# EAGLE design flight sim sch (EAGLE 9.6.2)
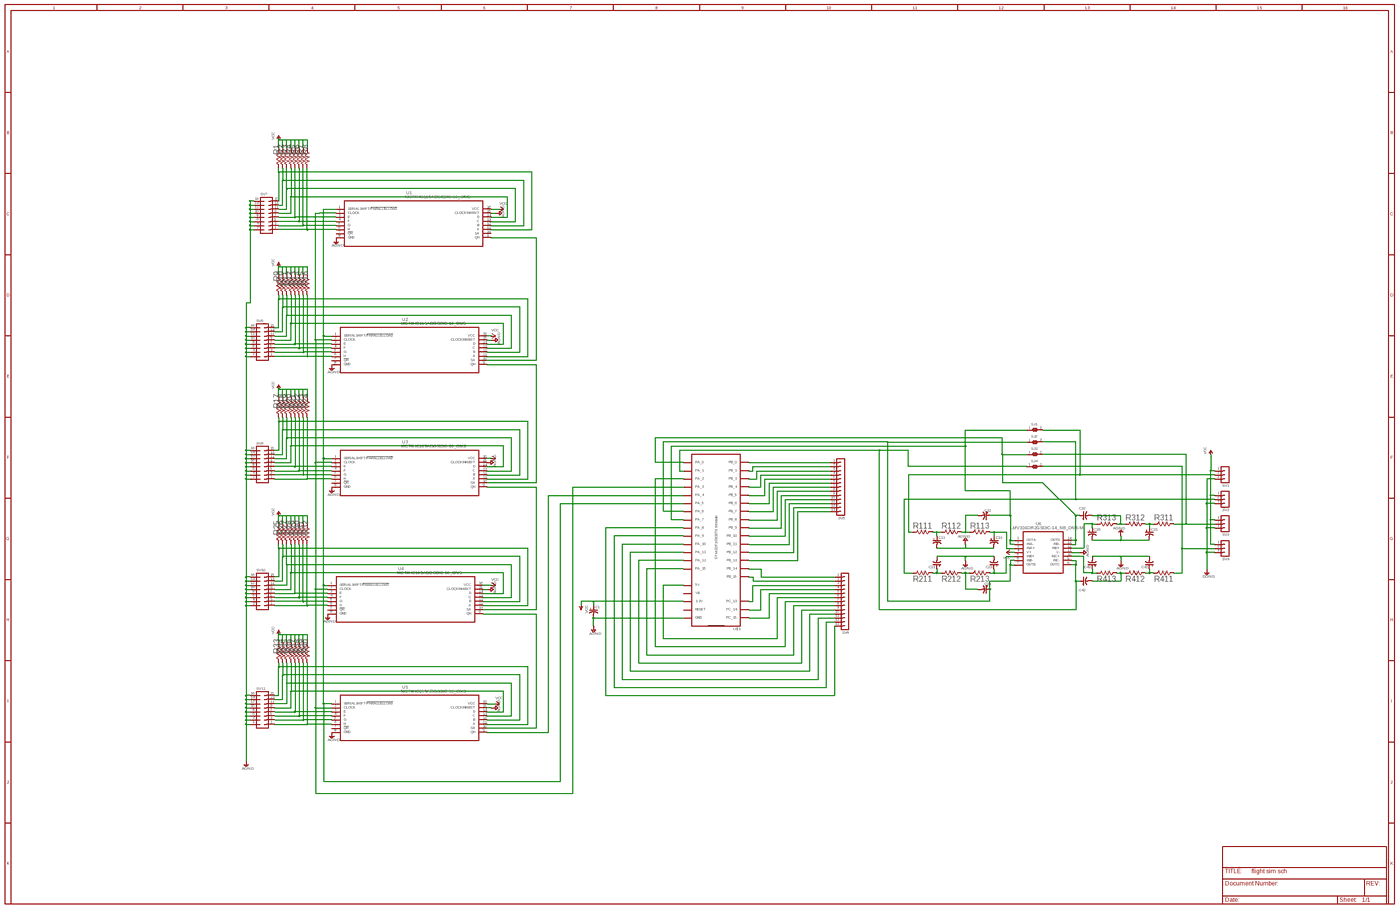
[diagram p0: schematic, sheet 1, overview]
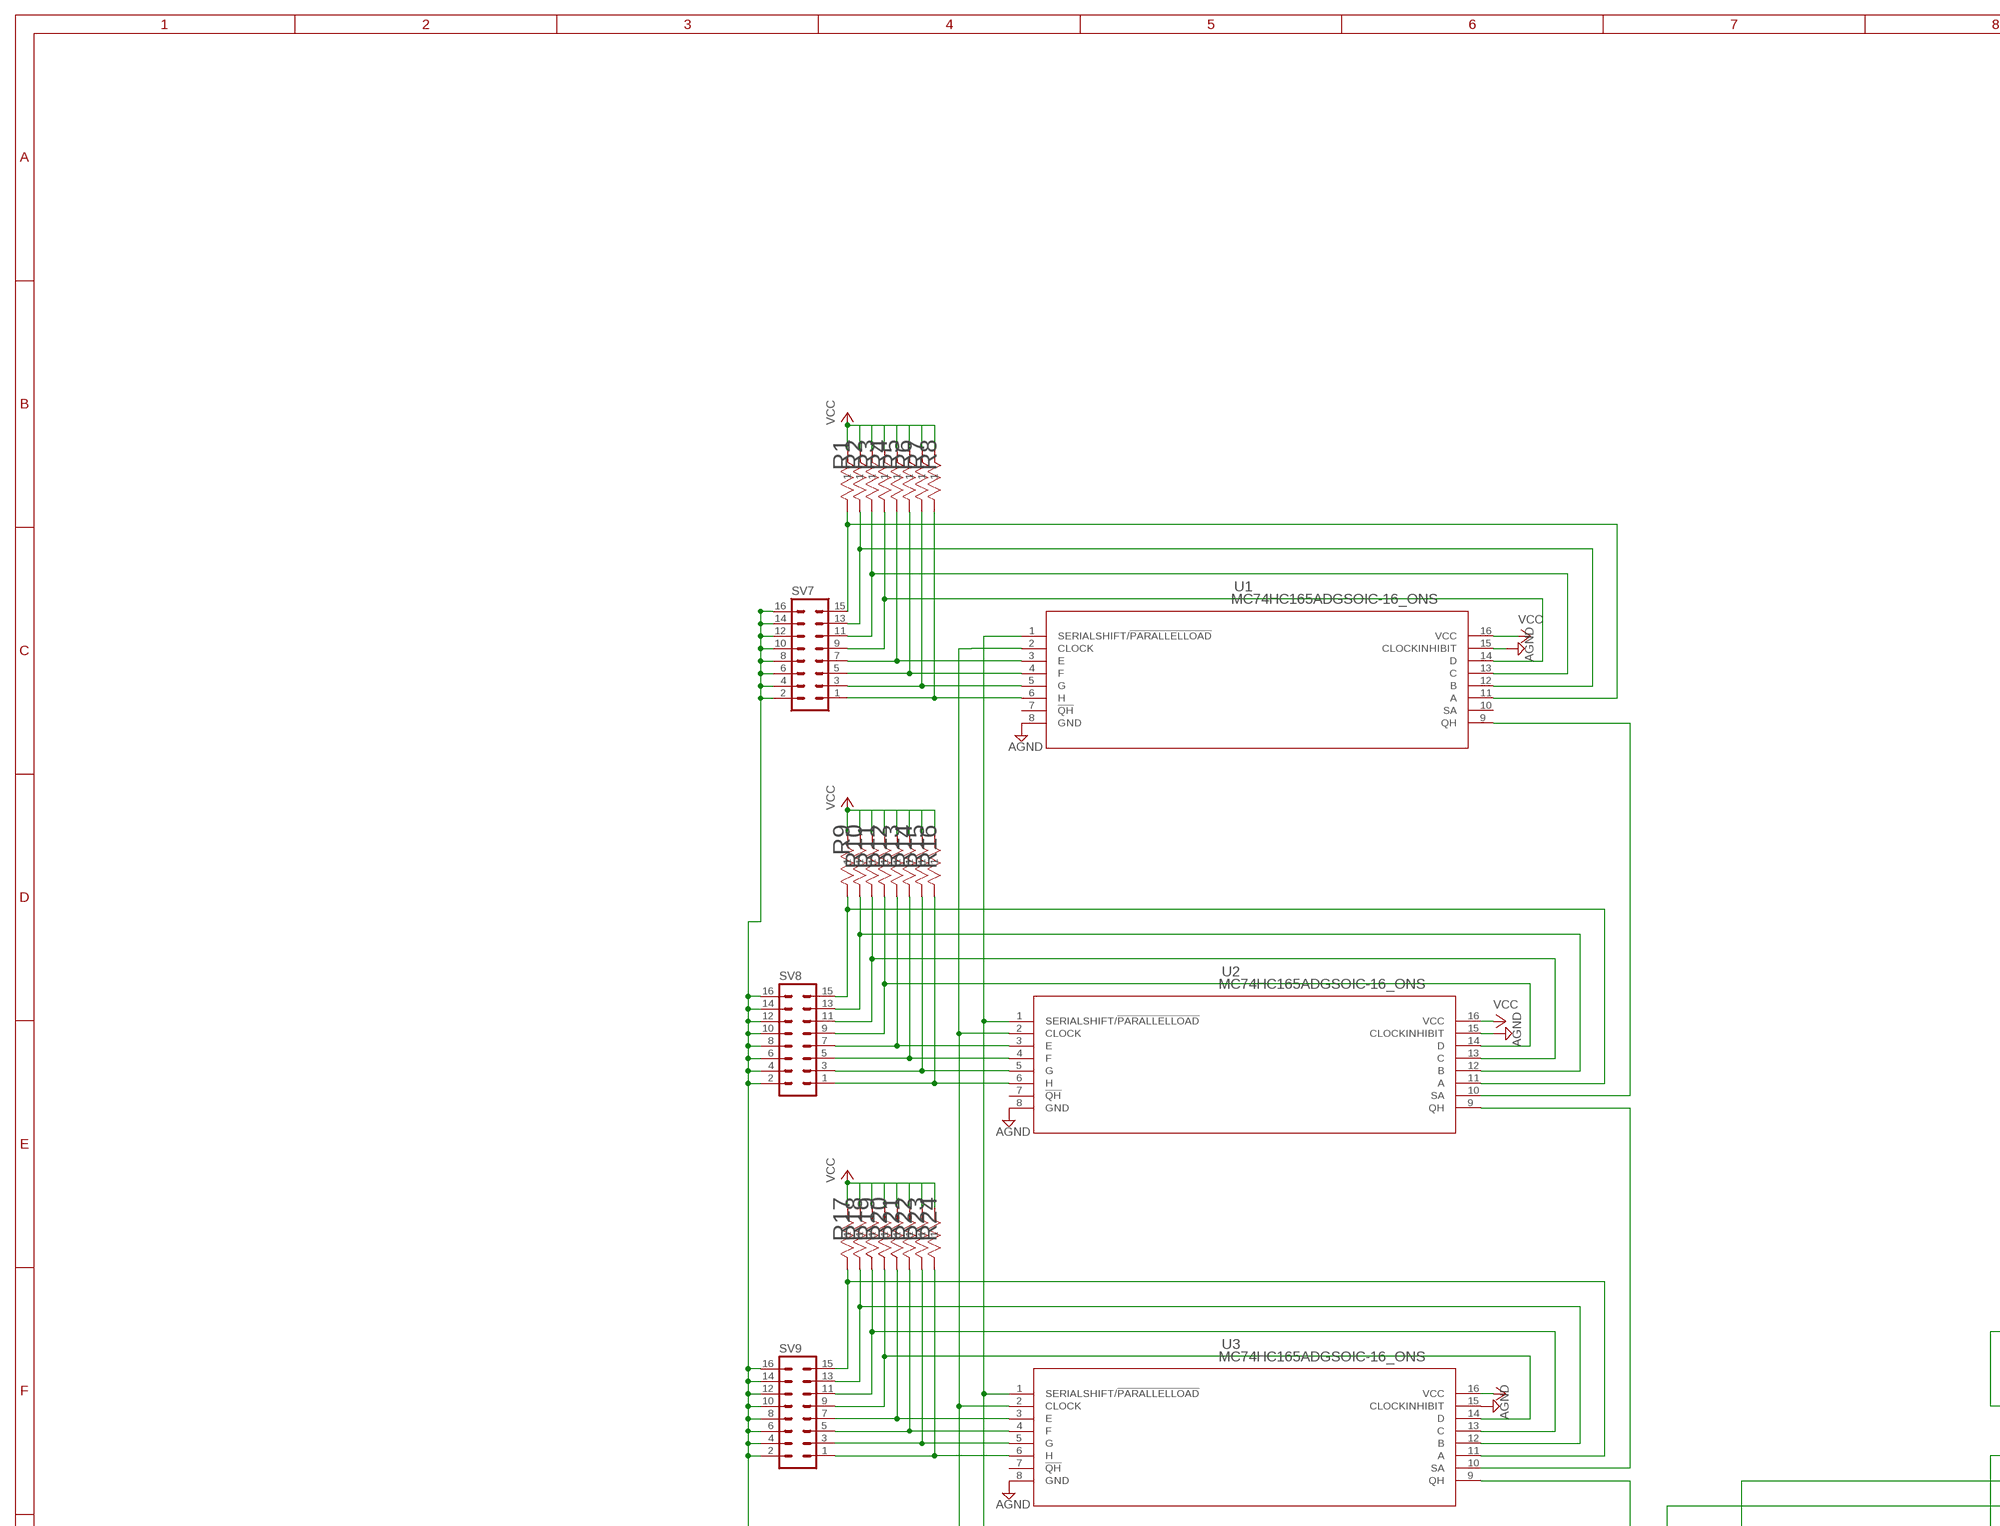
[diagram p1: schematic, sheet 1, part 1 of 4]
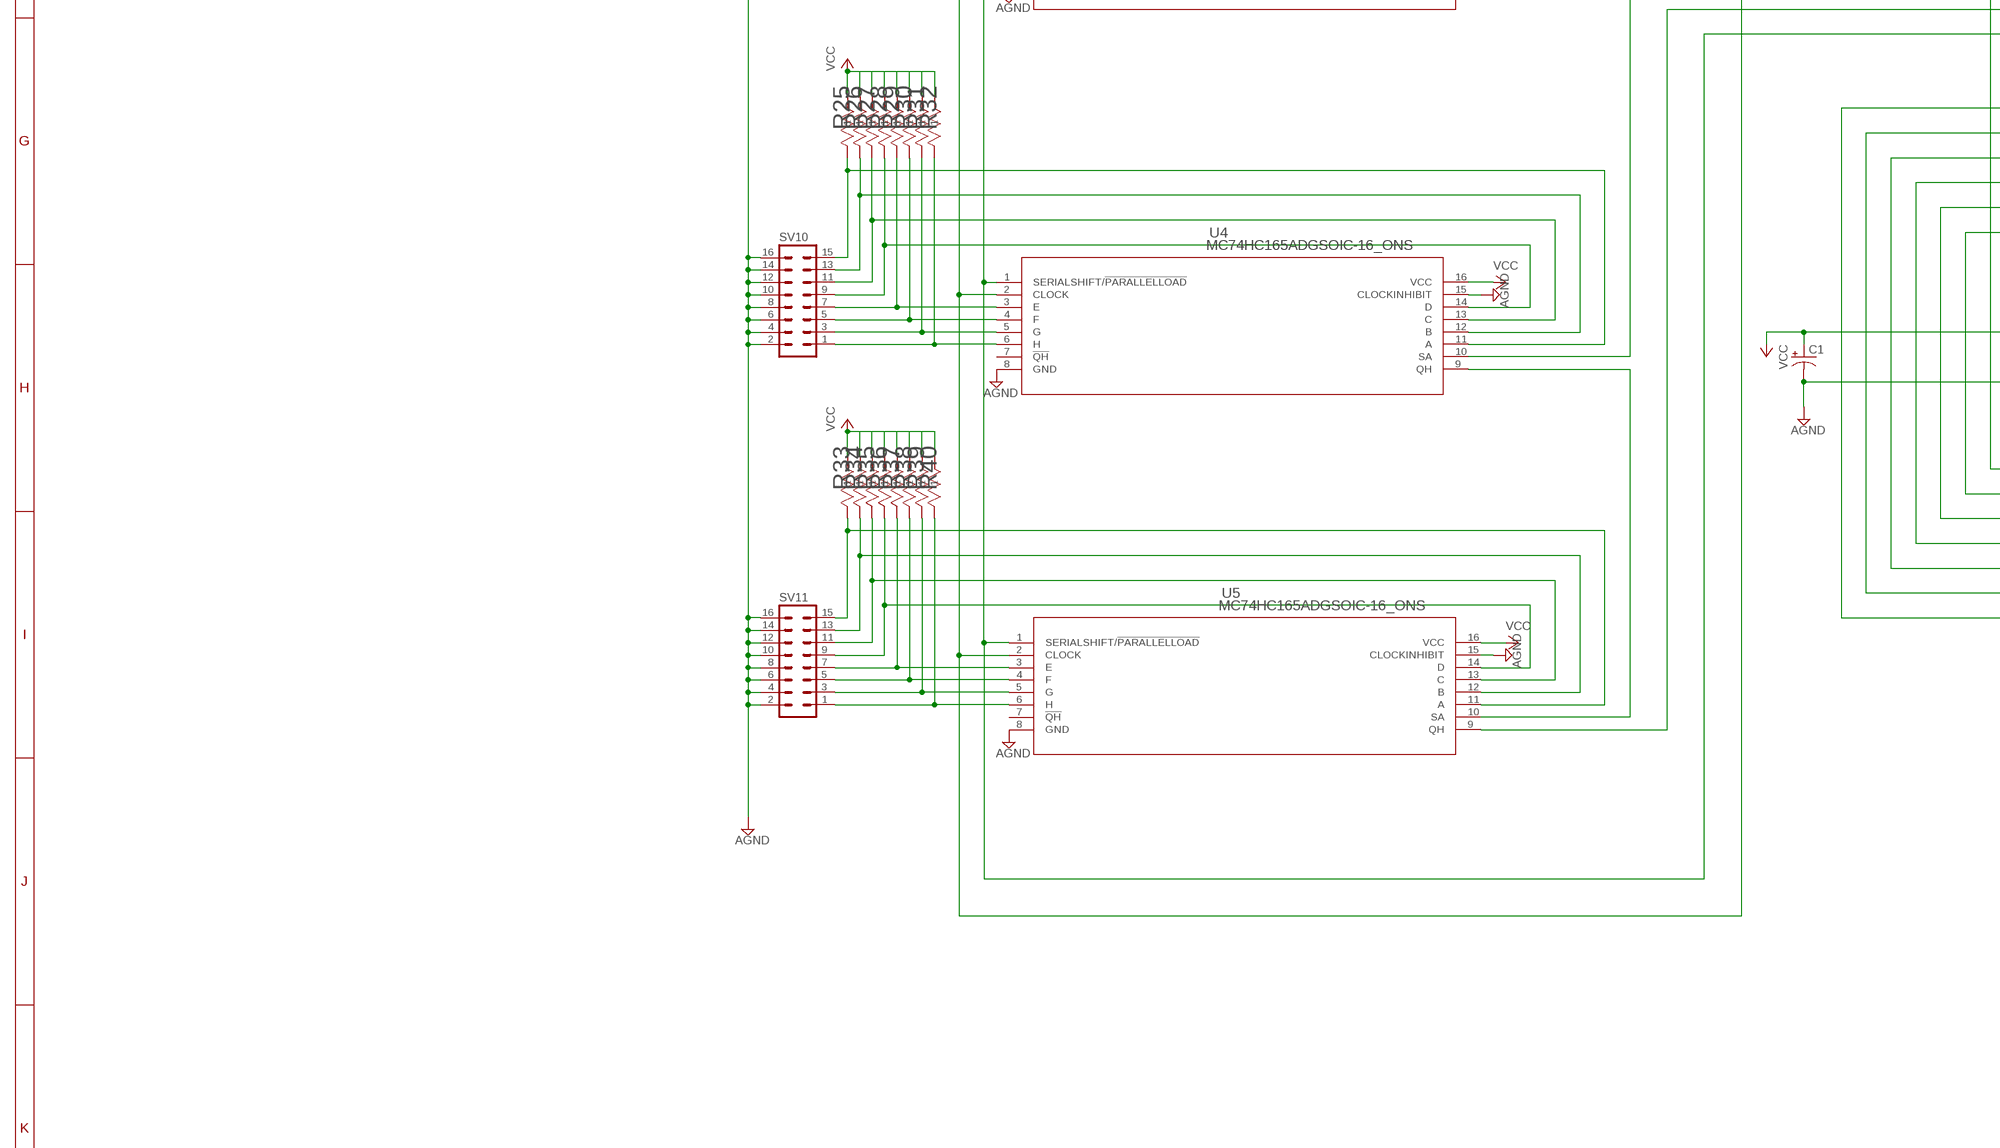
[diagram p2: schematic, sheet 1, part 2 of 4]
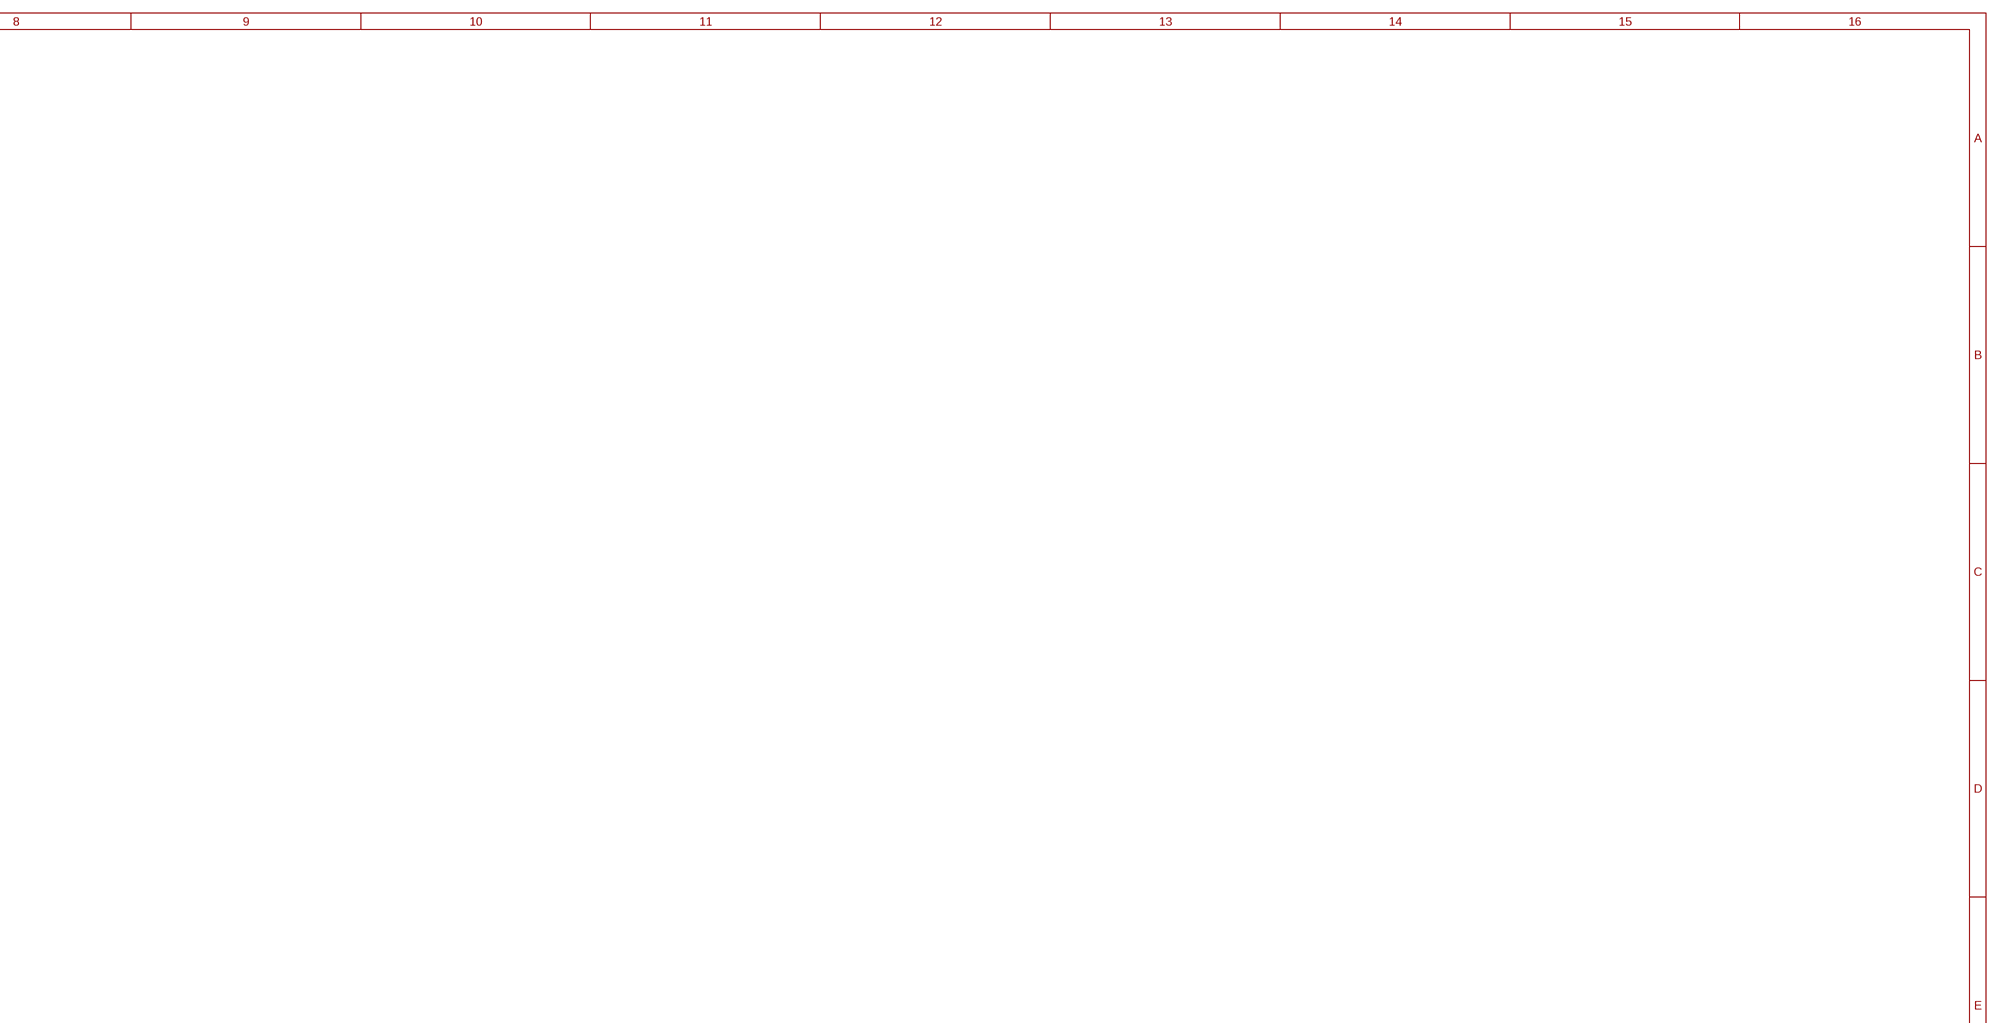
[diagram p3: schematic, sheet 1, part 3 of 4]
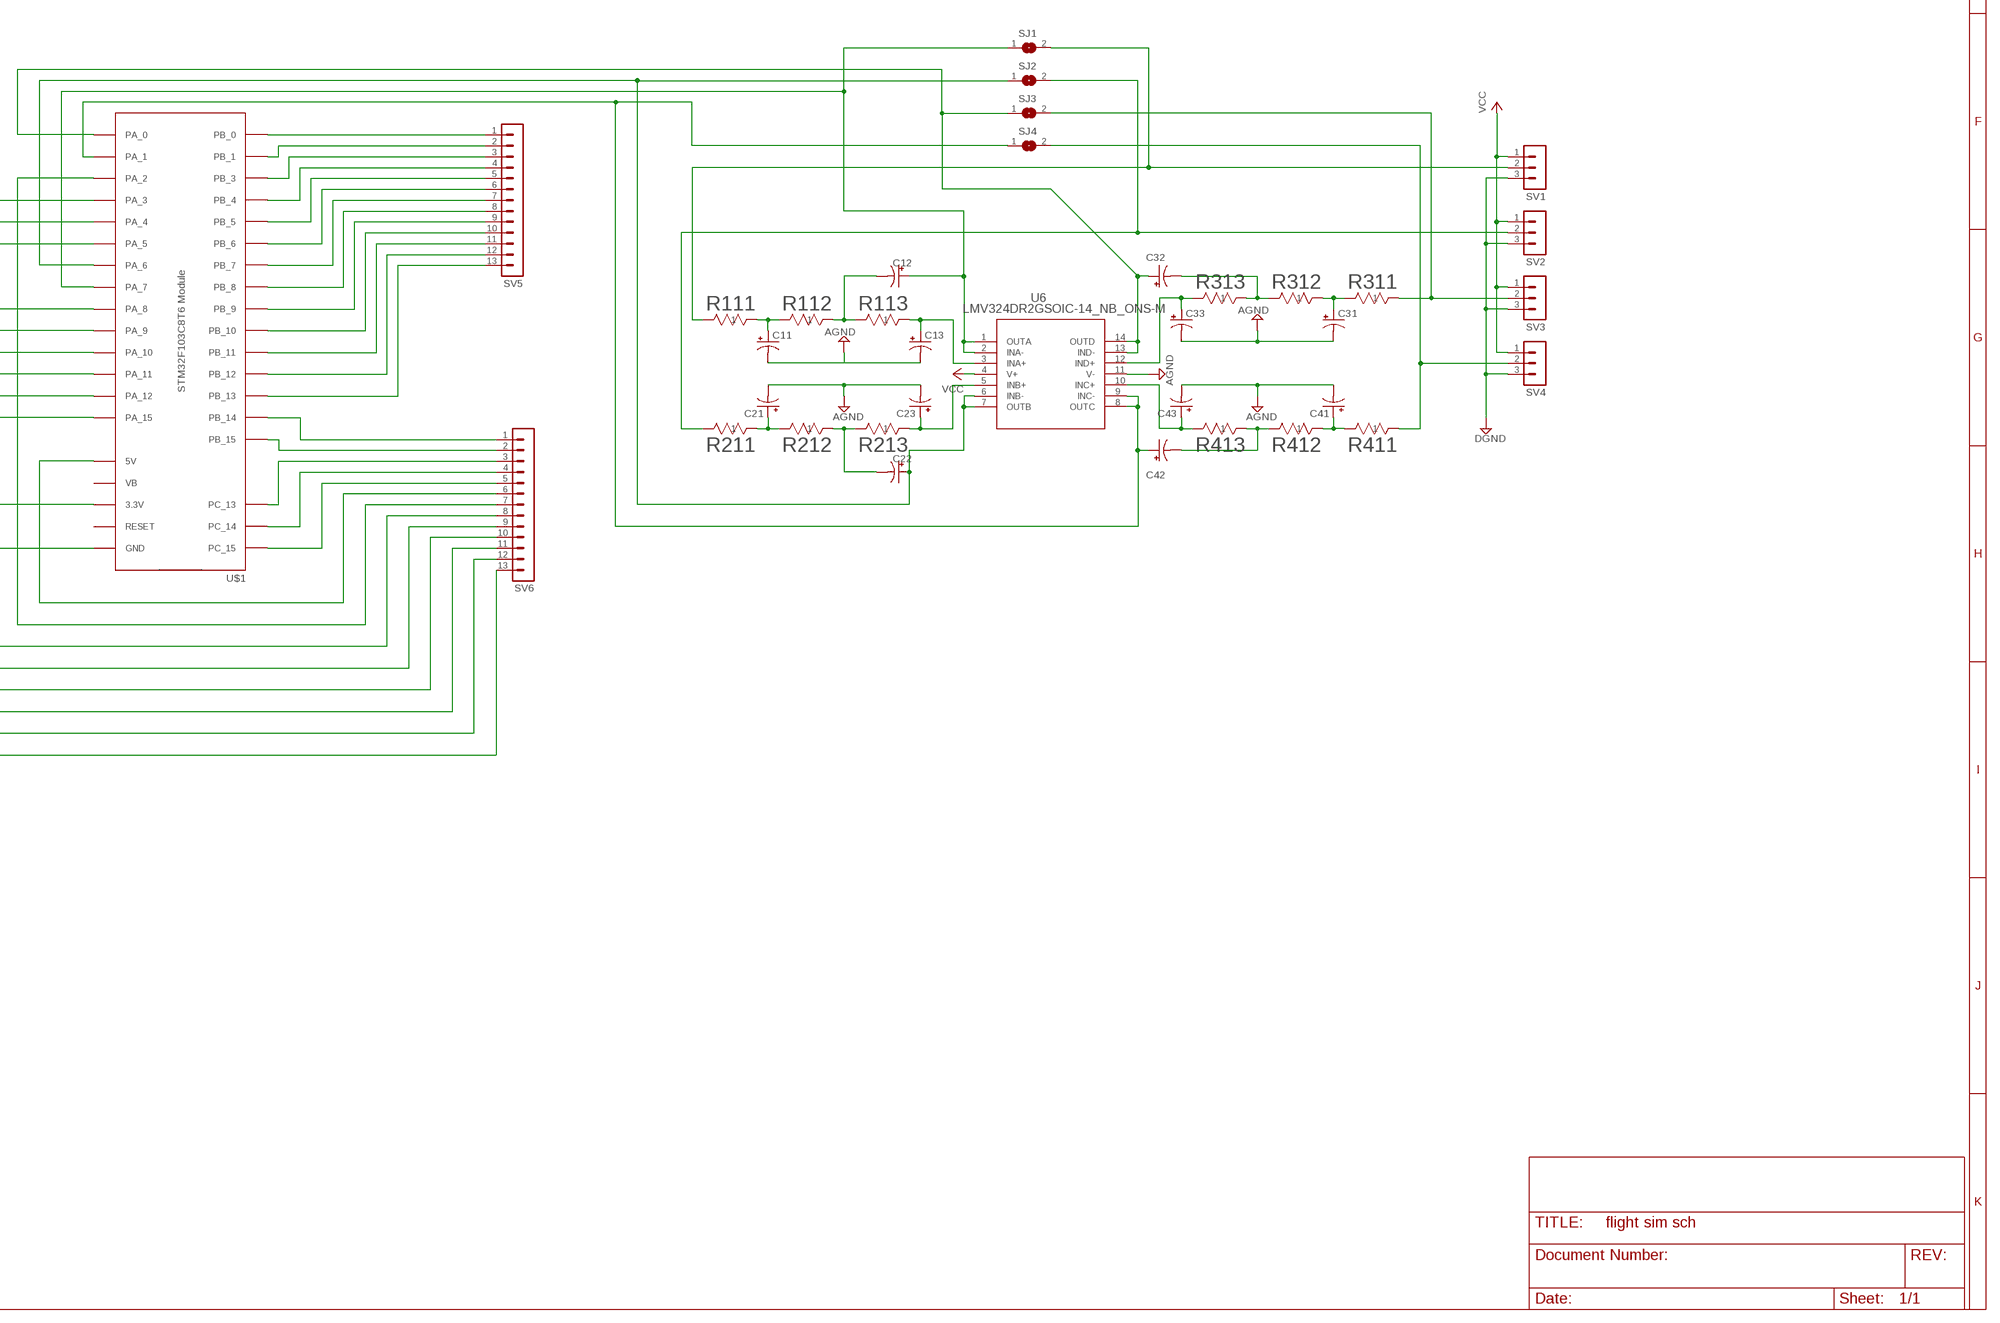
[diagram p4: schematic, sheet 1, part 4 of 4]

## Parts
C1  CPOL-USE1.8-4  [E1,8-4]
C11  CPOL-USE1.8-4  [E1,8-4]
C12  CPOL-USE1.8-4  [E1,8-4]
C13  CPOL-USE1.8-4  [E1,8-4]
C21  CPOL-USE1.8-4  [E1,8-4]
C22  CPOL-USE1.8-4  [E1,8-4]
C23  CPOL-USE1.8-4  [E1,8-4]
C31  CPOL-USE1.8-4  [E1,8-4]
C32  CPOL-USE1.8-4  [E1,8-4]
C33  CPOL-USE1.8-4  [E1,8-4]
C41  CPOL-USE1.8-4  [E1,8-4]
C42  CPOL-USE1.8-4  [E1,8-4]
C43  CPOL-USE1.8-4  [E1,8-4]
R1  MFR-25FRF52-10KYAG_MF25_YAG  [YAG_MF25_YAG]
R2  MFR-25FRF52-10KYAG_MF25_YAG  [YAG_MF25_YAG]
R3  MFR-25FRF52-10KYAG_MF25_YAG  [YAG_MF25_YAG]
R4  MFR-25FRF52-10KYAG_MF25_YAG  [YAG_MF25_YAG]
R5  MFR-25FRF52-10KYAG_MF25_YAG  [YAG_MF25_YAG]
R6  MFR-25FRF52-10KYAG_MF25_YAG  [YAG_MF25_YAG]
R7  MFR-25FRF52-10KYAG_MF25_YAG  [YAG_MF25_YAG]
R8  MFR-25FRF52-10KYAG_MF25_YAG  [YAG_MF25_YAG]
R9  MFR-25FRF52-10KYAG_MF25_YAG  [YAG_MF25_YAG]
R10  MFR-25FRF52-10KYAG_MF25_YAG  [YAG_MF25_YAG]
R11  MFR-25FRF52-10KYAG_MF25_YAG  [YAG_MF25_YAG]
R12  MFR-25FRF52-10KYAG_MF25_YAG  [YAG_MF25_YAG]
R13  MFR-25FRF52-10KYAG_MF25_YAG  [YAG_MF25_YAG]
R14  MFR-25FRF52-10KYAG_MF25_YAG  [YAG_MF25_YAG]
R15  MFR-25FRF52-10KYAG_MF25_YAG  [YAG_MF25_YAG]
R16  MFR-25FRF52-10KYAG_MF25_YAG  [YAG_MF25_YAG]
R17  MFR-25FRF52-10KYAG_MF25_YAG  [YAG_MF25_YAG]
R18  MFR-25FRF52-10KYAG_MF25_YAG  [YAG_MF25_YAG]
R19  MFR-25FRF52-10KYAG_MF25_YAG  [YAG_MF25_YAG]
R20  MFR-25FRF52-10KYAG_MF25_YAG  [YAG_MF25_YAG]
R21  MFR-25FRF52-10KYAG_MF25_YAG  [YAG_MF25_YAG]
R22  MFR-25FRF52-10KYAG_MF25_YAG  [YAG_MF25_YAG]
R23  MFR-25FRF52-10KYAG_MF25_YAG  [YAG_MF25_YAG]
R24  MFR-25FRF52-10KYAG_MF25_YAG  [YAG_MF25_YAG]
R25  MFR-25FRF52-10KYAG_MF25_YAG  [YAG_MF25_YAG]
R26  MFR-25FRF52-10KYAG_MF25_YAG  [YAG_MF25_YAG]
R27  MFR-25FRF52-10KYAG_MF25_YAG  [YAG_MF25_YAG]
R28  MFR-25FRF52-10KYAG_MF25_YAG  [YAG_MF25_YAG]
R29  MFR-25FRF52-10KYAG_MF25_YAG  [YAG_MF25_YAG]
R30  MFR-25FRF52-10KYAG_MF25_YAG  [YAG_MF25_YAG]
R31  MFR-25FRF52-10KYAG_MF25_YAG  [YAG_MF25_YAG]
R32  MFR-25FRF52-10KYAG_MF25_YAG  [YAG_MF25_YAG]
R33  MFR-25FRF52-10KYAG_MF25_YAG  [YAG_MF25_YAG]
R34  MFR-25FRF52-10KYAG_MF25_YAG  [YAG_MF25_YAG]
R35  MFR-25FRF52-10KYAG_MF25_YAG  [YAG_MF25_YAG]
R36  MFR-25FRF52-10KYAG_MF25_YAG  [YAG_MF25_YAG]
R37  MFR-25FRF52-10KYAG_MF25_YAG  [YAG_MF25_YAG]
R38  MFR-25FRF52-10KYAG_MF25_YAG  [YAG_MF25_YAG]
R39  MFR-25FRF52-10KYAG_MF25_YAG  [YAG_MF25_YAG]
R40  MFR-25FRF52-10KYAG_MF25_YAG  [YAG_MF25_YAG]
R111  MFR-25FRF52-10KYAG_MF25_YAG  [YAG_MF25_YAG]
R112  MFR-25FRF52-10KYAG_MF25_YAG  [YAG_MF25_YAG]
R113  MFR-25FRF52-10KYAG_MF25_YAG  [YAG_MF25_YAG]
R211  MFR-25FRF52-10KYAG_MF25_YAG  [YAG_MF25_YAG]
R212  MFR-25FRF52-10KYAG_MF25_YAG  [YAG_MF25_YAG]
R213  MFR-25FRF52-10KYAG_MF25_YAG  [YAG_MF25_YAG]
R311  MFR-25FRF52-10KYAG_MF25_YAG  [YAG_MF25_YAG]
R312  MFR-25FRF52-10KYAG_MF25_YAG  [YAG_MF25_YAG]
R313  MFR-25FRF52-10KYAG_MF25_YAG  [YAG_MF25_YAG]
R411  MFR-25FRF52-10KYAG_MF25_YAG  [YAG_MF25_YAG]
R412  MFR-25FRF52-10KYAG_MF25_YAG  [YAG_MF25_YAG]
R413  MFR-25FRF52-10KYAG_MF25_YAG  [YAG_MF25_YAG]
SJ1  SJ  [SJ]
SJ2  SJ  [SJ]
SJ3  SJ  [SJ]
SJ4  SJ  [SJ]
SV1  MA03-1  [MA03-1]
SV2  MA03-1  [MA03-1]
SV3  MA03-1  [MA03-1]
SV4  MA03-1  [MA03-1]
SV5  MA13-1  [MA13-1]
SV6  MA13-1  [MA13-1]
SV7  MA08-2  [MA08-2]
SV8  MA08-2  [MA08-2]
SV9  MA08-2  [MA08-2]
SV10  MA08-2  [MA08-2]
SV11  MA08-2  [MA08-2]
U1  MC74HC165ADGSOIC-16_ONS  [SOIC-16_ONS]
U2  MC74HC165ADGSOIC-16_ONS  [SOIC-16_ONS]
U3  MC74HC165ADGSOIC-16_ONS  [SOIC-16_ONS]
U4  MC74HC165ADGSOIC-16_ONS  [SOIC-16_ONS]
U5  MC74HC165ADGSOIC-16_ONS  [SOIC-16_ONS]
U6  LMV324DR2GSOIC-14_NB_ONS-M  [SOIC-14_NB_ONS-M]
U$1  STM32F103C8T6-MODULE  [STM32F103C8T6-MODULE]

## Nets
AGND: C1.- C11.- C13.- C21.- C23.- C31.- C33.- C41.- C43.- SV7.2 SV7.4 SV7.6 SV7.8 SV7.10 SV7.12 SV7.14 SV7.16 SV8.2 SV8.4 SV8.6 SV8.8 SV8.10 SV8.12 SV8.14 SV8.16 SV9.2 SV9.4 SV9.6 SV9.8 SV9.10 SV9.12 SV9.14 SV9.16 SV10.2 SV10.4 SV10.6 SV10.8 SV10.10 SV10.12 SV10.14 SV10.16 SV11.2 SV11.4 SV11.6 SV11.8 SV11.10 SV11.12 SV11.14 SV11.16 U1.8(GND) U1.15(CLOCKINHIBIT) U2.8(GND) U2.15(CLOCKINHIBIT) U3.8(GND) U3.15(CLOCKINHIBIT) U4.8(GND) U4.15(CLOCKINHIBIT) U5.8(GND) U5.15(CLOCKINHIBIT) U6.11(V-) U$1.GND@1(GND) U$1.GND@2(GND) U$1.GND@3(GND)
DGND: SV1.3 SV2.3 SV3.3 SV4.3
N$1: U1.9(QH) U2.10(SA)
N$2: R8.2 SV7.1 U1.6(H)
N$3: R7.2 SV7.3 U1.5(G)
N$4: R6.2 SV7.5 U1.4(F)
N$5: R5.2 SV7.7 U1.3(E)
N$6: R4.2 SV7.9 U1.14(D)
N$7: R3.2 SV7.11 U1.13(C)
N$8: R2.2 SV7.13 U1.12(B)
N$9: R1.2 SV7.15 U1.11(A)
N$10: U1.2(CLOCK) U2.2(CLOCK) U3.2(CLOCK) U4.2(CLOCK) U5.2(CLOCK) U$1.PA_3
N$13: R16.2 SV8.1 U2.6(H)
N$14: R15.2 SV8.3 U2.5(G)
N$15: R14.2 SV8.5 U2.4(F)
N$16: R13.2 SV8.7 U2.3(E)
N$18: R24.2 SV9.1 U3.6(H)
N$19: R23.2 SV9.3 U3.5(G)
N$20: R22.2 SV9.5 U3.4(F)
N$21: R21.2 SV9.7 U3.3(E)
N$22: R20.2 SV9.9 U3.14(D)
N$23: R19.2 SV9.11 U3.13(C)
N$24: R18.2 SV9.13 U3.12(B)
N$25: R12.2 SV8.9 U2.14(D)
N$26: R32.2 SV10.1 U4.6(H)
N$27: R31.2 SV10.3 U4.5(G)
N$28: R30.2 SV10.5 U4.4(F)
N$29: R29.2 SV10.7 U4.3(E)
N$30: R28.2 SV10.9 U4.14(D)
N$31: R27.2 SV10.11 U4.13(C)
N$32: R26.2 SV10.13 U4.12(B)
N$33: R33.2 SV11.15 U5.11(A)
N$34: R25.2 SV10.15 U4.11(A)
N$35: R34.2 SV11.13 U5.12(B)
N$36: R11.2 SV8.11 U2.13(C)
N$37: R35.2 SV11.11 U5.13(C)
N$38: R36.2 SV11.9 U5.14(D)
N$39: R37.2 SV11.7 U5.3(E)
N$40: R38.2 SV11.5 U5.4(F)
N$41: R39.2 SV11.3 U5.5(G)
N$42: U2.9(QH) U3.10(SA)
N$44: C11.+ R111.1 R112.2
N$45: U3.9(QH) U4.10(SA)
N$46: U4.9(QH) U5.10(SA)
N$47: U5.9(QH) U$1.PA_4
N$48: U1.1(SERIALSHIFT/!PARALLELLOAD) U2.1(SERIALSHIFT/!PARALLELLOAD) U3.1(SERIALSHIFT/!PARALLELLOAD) U4.1(SERIALSHIFT/!PARALLELLOAD) U5.1(SERIALSHIFT/!PARALLELLOAD) U$1.PA_5
N$49: R40.2 SV11.1 U5.6(H)
N$50: C22.- R212.1 R213.2
N$51: C21.+ R211.1 R212.2
N$52: C13.+ R113.1 U6.3(INA+)
N$53: C12.+ SJ1.1 U6.1(OUTA) U6.2(INA-) U$1.PA_7
N$54: C12.- R112.1 R113.2
N$55: R10.2 SV8.13 U2.12(B)
N$56: R9.2 SV8.15 U2.11(A)
N$57: C42.- R412.2 R413.1
N$58: C23.+ R213.1 U6.5(INB+)
N$60: R17.2 SV9.15 U3.11(A)
N$62: C33.+ R313.2 U6.12(IND+)
N$64: C31.+ R311.2 R312.1
N$65: C43.+ R413.2 U6.10(INC+)
N$68: C41.+ R411.2 R412.1
N$72: C32.- R312.2 R313.1
N$95: SV6.7 U$1.PA_2
N$99: SV6.6 U$1.5V
N$A8: SV6.13 U$1.PA_8
N$A9: SV6.12 U$1.PA_9
N$A10: SV6.11 U$1.PA_10
N$A11: SV6.10 U$1.PA_11
N$A12: SV6.9 U$1.PA_12
N$A15: SV6.8 U$1.PA_15
N$B0: SV5.1 U$1.PB_0
N$B1: SV5.2 U$1.PB_1
N$B3: SV5.3 U$1.PB_3
N$B4: SV5.4 U$1.PB_4
N$B5: SV5.5 U$1.PB_5
N$B6: SV5.6 U$1.PB_6
N$B7: SV5.7 U$1.PB_7
N$B8: SV5.8 U$1.PB_8
N$B9: SV5.9 U$1.PB_9
N$B10: SV5.10 U$1.PB_10
N$B11: SV5.11 U$1.PB_11
N$B12: SV5.12 U$1.PB_12
N$B13: SV5.13 U$1.PB_13
N$B14: SV6.1 U$1.PB_14
N$B15: SV6.2 U$1.PB_15
N$C13: SV6.3 U$1.PC_13
N$C14: SV6.4 U$1.PC_14
N$C15: SV6.5 U$1.PC_15
N$FILTER2OUT: C22.+ SJ2.1 U6.6(INB-) U6.7(OUTB) U$1.PA_6
N$FILTER3OUT: C32.+ SJ3.1 U6.13(IND-) U6.14(OUTD) U$1.PA_0
N$FILTER4OUT: C42.+ SJ4.1 U6.8(OUTC) U6.9(INC-) U$1.PA_1
N$POT1IN: R111.2 SJ1.2 SV1.2
N$POT2IN: R211.2 SJ2.2 SV2.2
N$POT3IN: R311.1 SJ3.2 SV3.2
N$POT4IN: R411.1 SJ4.2 SV4.2
VCC: C1.+ R1.1 R2.1 R3.1 R4.1 R5.1 R6.1 R7.1 R8.1 R9.1 R10.1 R11.1 R12.1 R13.1 R14.1 R15.1 R16.1 R17.1 R18.1 R19.1 R20.1 R21.1 R22.1 R23.1 R24.1 R25.1 R26.1 R27.1 R28.1 R29.1 R30.1 R31.1 R32.1 R33.1 R34.1 R35.1 R36.1 R37.1 R38.1 R39.1 R40.1 SV1.1 SV2.1 SV3.1 SV4.1 U1.16(VCC) U2.16(VCC) U3.16(VCC) U4.16(VCC) U5.16(VCC) U6.4(V+) U$1.3.3V@1(3.3V) U$1.3.3V@2(3.3V)
Unconnected: U1.7(!QH) U1.10(SA) U2.7(!QH) U3.7(!QH) U4.7(!QH) U5.7(!QH) U$1.RESET U$1.VB

## Library data of the parts
C1 C11-C13 C21-C23 C31-C33 C41-C43 = rcl:CPOL-US: POLARIZED CAPACITOR, American symbol; SPICEPREFIX: C
R1-R40 R111-R113 R211-R213 R311-R313 R411-R413 = 2022-07-17_18-22-41_Library:MFR-25FRF52-10K; COPYRIGHT: Copyright (C) 2022 Ultra Librarian. All rights reserved.; DIGI-KEY_PART_NUMBER_1: 10.0KXTR-ND; MANUFACTURER_PART_NUMBER: MFR-25FRF52-10K; MFR_NAME: Yageo
SJ1-SJ4 = jumper:SJ: SMD solder JUMPER
SV1-SV4 = con-lstb:MA03-1: PIN HEADER; OC_FARNELL: unknown; OC_NEWARK: unknown
SV5 SV6 = con-lstb:MA13-1: PIN HEADER; OC_FARNELL: unknown; OC_NEWARK: unknown
SV7-SV11 = con-lstb:MA08-2: PIN HEADER; OC_FARNELL: unknown; OC_NEWARK: unknown
U1-U5 = 2022-07-17_01-24-19_Library:MC74HC165ADG; COPYRIGHT: Copyright (C) 2022 Ultra Librarian. All rights reserved.; DIGI-KEY_PART_NUMBER_1: MC74HC165ADGOS-ND; DIGI-KEY_PART_NUMBER_2: 2156-MC74HC165ADG-OS-ND; MANUFACTURER_PART_NUMBER: MC74HC165ADG; MFR_NAME: onsemi
U6 = 2022-07-18_04-16-53_Library:LMV324DR2G; COPYRIGHT: Copyright (C) 2022 Ultra Librarian. All rights reserved.; DIGI-KEY_PART_NUMBER_1: LMV324DR2GOSCT-ND; DIGI-KEY_PART_NUMBER_2: LMV324DR2GOSDKR-ND; DIGI-KEY_PART_NUMBER_3: LMV324DR2GOSTR-ND; DIGI-KEY_PART_NUMBER_4: 2156-LMV324DR2G-OS-ND; MANUFACTURER_PART_NUMBER: LMV324DR2G; MFR_NAME: onsemi
U$1 = bluepill_eagle_lib:STM32F103C8T6-MODULE: STM32F103C8T6 module with ARM Cortex-3, 20kB SRAM, 64kB Flash, 72MHz

## Board
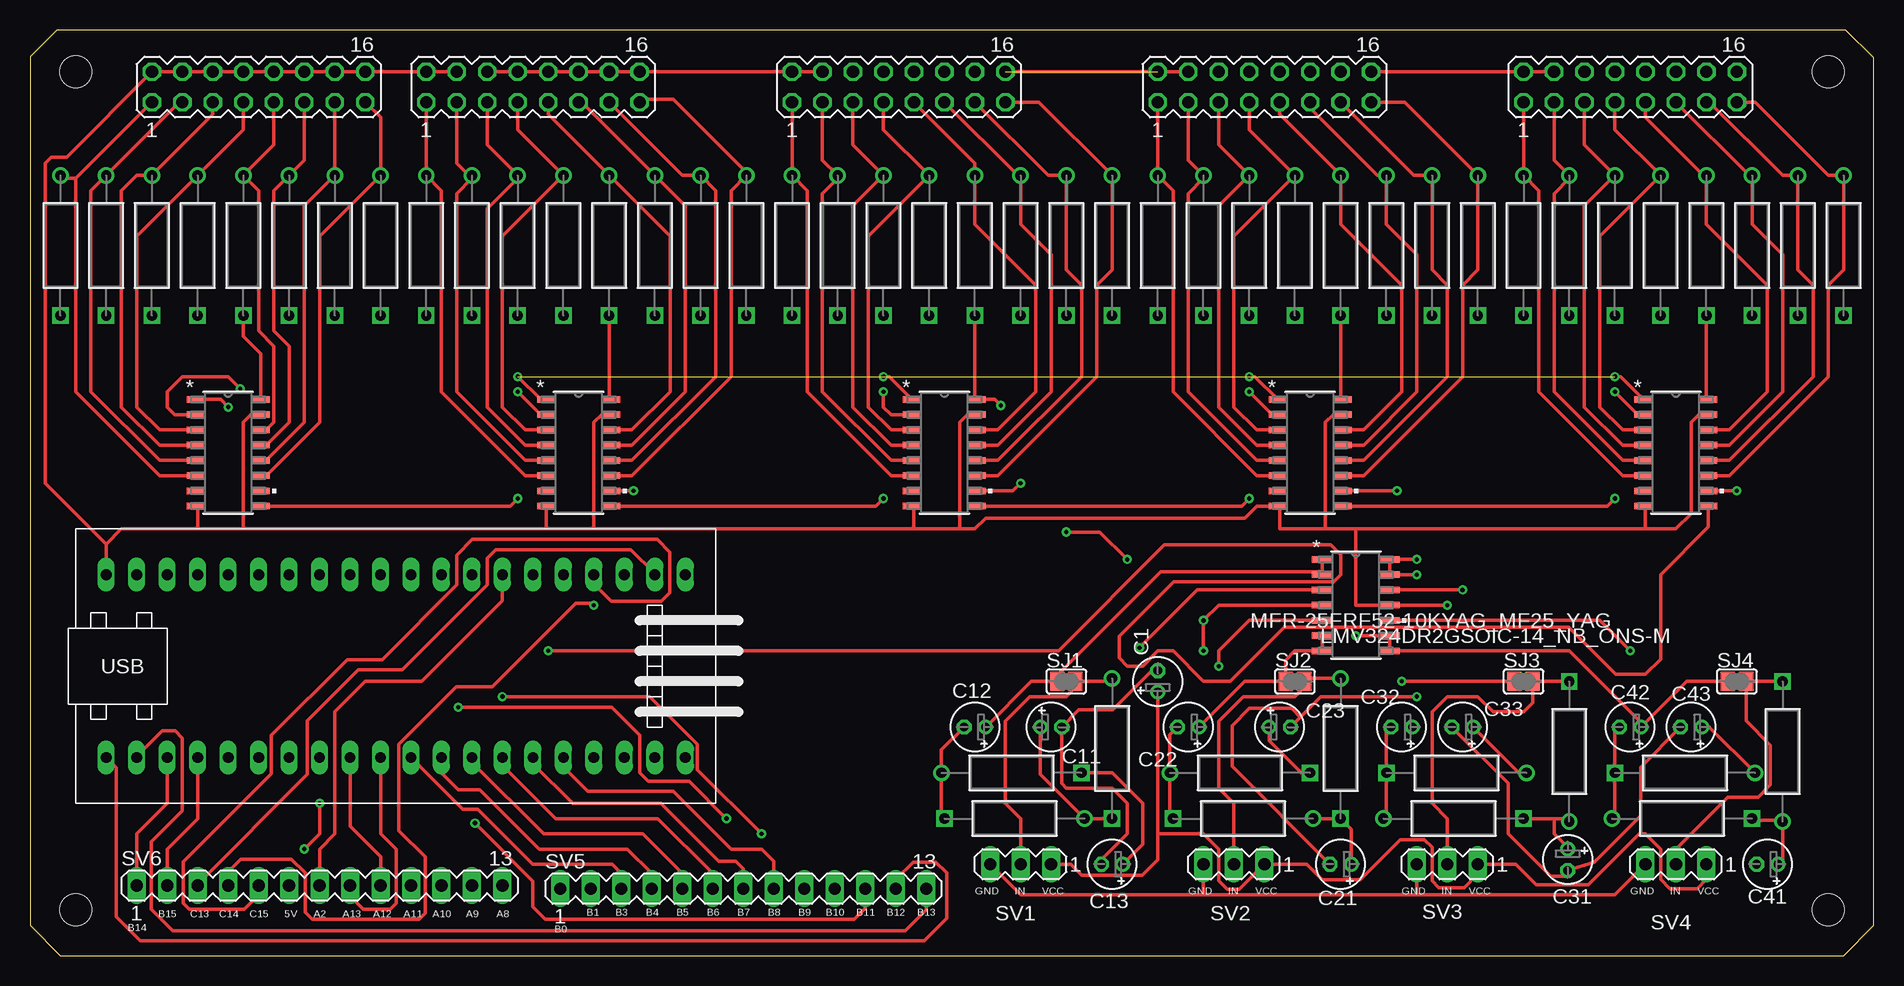
[diagram p5: board, top side]
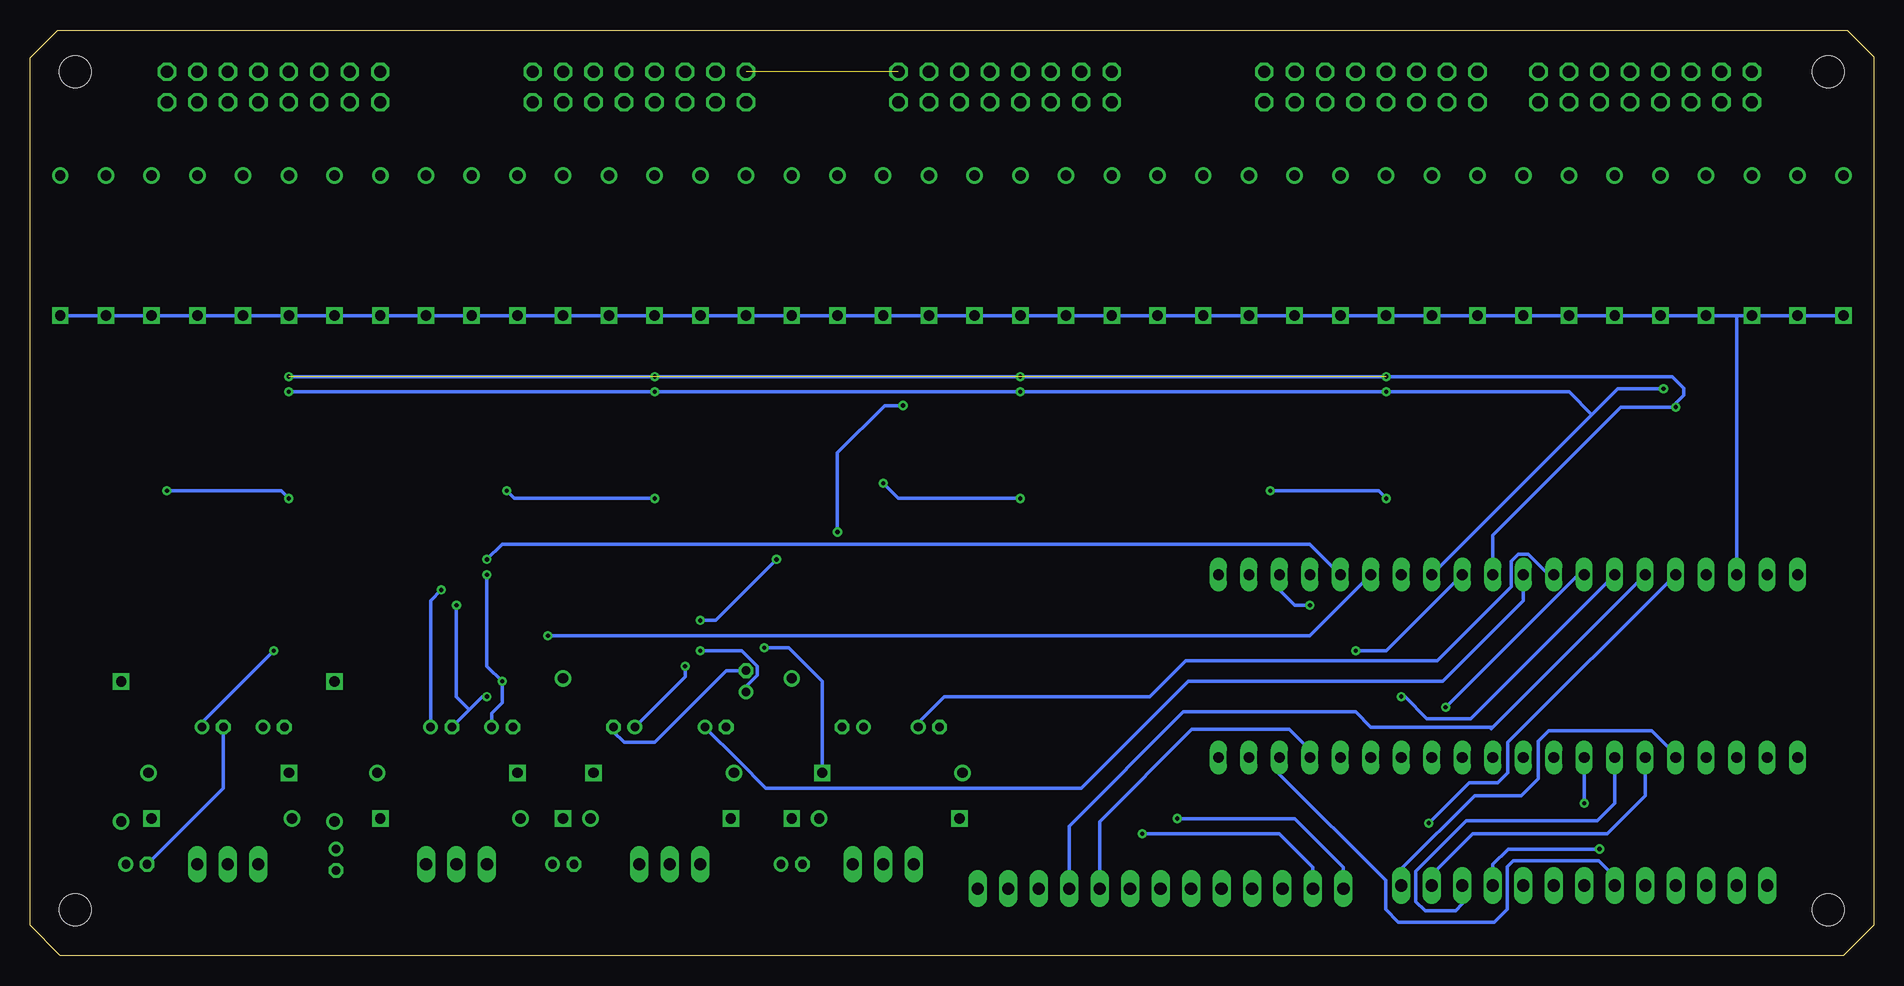
[diagram p6: board, bottom side, seen from below]

Size 153.65 x 77.14 mm. Coordinates in mm from the lower left corner, seen from the top.
Outline: 153.65,2.52 153.65,74.82 151.33,77.14 2.21,77.14 0,74.93 0,2.54 2.54,0 151.13,0 153.65,2.52
Copper layers (1*16): Top 0.035mm / dielectric 1.5mm / Bottom 0.035mm
Design rules "default": minimum track width 6mil, minimum drill 0.35mm, track to track 6mil, track to pad 6mil, pad to pad 6mil, via to via 6mil, smd to smd 6mil, copper to edge 40mil, drill to drill 6mil, minimum pad ring 10mil, minimum via ring 8mil, stop-mask expansion 4mil, vias tented up to drill 0mil, thermal gap 10mil
Holes 2.65 mm at 3.81,3.81 3.81,73.66 149.86,73.66 149.86,3.81

### Footprints (pad centres in the part's own frame; a part is rotated, then mirrored left to right if it is on the bottom)
E1,8-4 = drill 0.711 pad 1.168: + -0.889,0 | drill 0.711 pad 1.168 octagon: - 0.889,0
YAG_MF25_YAG = drill 0.864 pad 1.372 square: 1 0,0 | drill 0.864 pad 1.372: 2 11.684,0
SJ = smd 1.168 x 1.6: 1 -0.762,0; 2 0.762,0
MA03-1 = drill 1.016 long: 1 -2.54,0; 2 0,0; 3 2.54,0
MA13-1 = drill 1.016 long: 1 -15.24,0; 2 -12.7,0; 3 -10.16,0; 4 -7.62,0; 5 -5.08,0; 6 -2.54,0; 7 0,0; 8 2.54,0; 9 5.08,0; 10 7.62,0; 11 10.16,0; 12 12.7,0; 13 15.24,0
MA08-2 = drill 1.016 octagon: 1 -8.89,-1.27; 2 -8.89,1.27; 3 -6.35,-1.27; 4 -6.35,1.27; 5 -3.81,-1.27; 6 -3.81,1.27; 7 -1.27,-1.27; 8 -1.27,1.27; 9 1.27,-1.27; 10 1.27,1.27; 11 3.81,-1.27; 12 3.81,1.27; 13 6.35,-1.27; 14 6.35,1.27; 15 8.89,-1.27; 16 8.89,1.27
SOIC-16_ONS = smd 1.499 x 0.533: 1 -2.705,4.445; 2 -2.705,3.175; 3 -2.705,1.905; 4 -2.705,0.635; 5 -2.705,-0.635; 6 -2.705,-1.905; 7 -2.705,-3.175; 8 -2.705,-4.445; 9 2.705,-4.445; 10 2.705,-3.175; 11 2.705,-1.905; 12 2.705,-0.635; 13 2.705,0.635; 14 2.705,1.905; 15 2.705,3.175; 16 2.705,4.445
SOIC-14_NB_ONS-M = smd 1.702 x 0.533: 1 -2.807,3.81; 2 -2.807,2.54; 3 -2.807,1.27; 4 -2.807,0; 5 -2.807,-1.27; 6 -2.807,-2.54; 7 -2.807,-3.81; 8 2.807,-3.81; 9 2.807,-2.54; 10 2.807,-1.27; 11 2.807,0; 12 2.807,1.27; 13 2.807,2.54; 14 2.807,3.81
STM32F103C8T6-MODULE = drill 0.9 long: 3.3V@1 25.4,-7.62; 3.3V@2 -17.78,7.62; 5V 20.32,-7.62; GND@1 22.86,-7.62; GND@2 -20.32,7.62; GND@3 -22.86,7.62; PA_0 15.24,7.62; PA_1 12.7,7.62; PA_2 10.16,7.62; PA_3 7.62,7.62; PA_4 5.08,7.62; PA_5 2.54,7.62; PA_6 0,7.62; PA_7 -2.54,7.62; PA_8 -12.7,-7.62; PA_9 -10.16,-7.62; PA_10 -7.62,-7.62; PA_11 -5.08,-7.62; PA_12 -2.54,-7.62; PA_15 0,-7.62; PB_0 -5.08,7.62; PB_1 -7.62,7.62; PB_3 2.54,-7.62; PB_4 5.08,-7.62; PB_5 7.62,-7.62; PB_6 10.16,-7.62; PB_7 12.7,-7.62; PB_8 15.24,-7.62; PB_9 17.78,-7.62; PB_10 -10.16,7.62; PB_11 -12.7,7.62; PB_12 -22.86,-7.62; PB_13 -20.32,-7.62; PB_14 -17.78,-7.62; PB_15 -15.24,-7.62; PC_13 22.86,7.62; PC_14 20.32,7.62; PC_15 17.78,7.62; RESET -15.24,7.62; VB 25.4,7.62

### Placement (x,y rotation side)
C1  93.98,22.86 90 top
C11  85.09,19.05 0 top
C12  78.74,19.05 180 top
C13  90.17,7.62 180 top
C21  109.22,7.62 180 top
C22  96.52,19.05 180 top
C23  104.14,19.05 0 top
C31  128.14,8 270 top
C32  114.3,19.05 180 top
C33  119.38,19.05 180 top
C41  144.78,7.62 180 top
C42  133.35,19.05 180 top
C43  138.43,19.05 180 top
R1  29.21,53.34 90 top
R2  25.4,53.34 90 top
R3  21.59,53.34 90 top
R4  17.78,53.34 90 top
R5  13.97,53.34 90 top
R6  10.16,53.34 90 top
R7  6.35,53.34 90 top
R8  2.54,53.34 90 top
R9  59.69,53.34 90 top
R10  55.88,53.34 90 top
R11  52.07,53.34 90 top
R12  48.26,53.34 90 top
R13  44.45,53.34 90 top
R14  40.64,53.34 90 top
R15  36.83,53.34 90 top
R16  33.02,53.34 90 top
R17  90.17,53.34 90 top
R18  86.36,53.34 90 top
R19  82.55,53.34 90 top
R20  78.74,53.34 90 top
R21  74.93,53.34 90 top
R22  71.12,53.34 90 top
R23  67.31,53.34 90 top
R24  63.5,53.34 90 top
R25  120.65,53.34 90 top
R26  116.84,53.34 90 top
R27  113.03,53.34 90 top
R28  109.22,53.34 90 top
R29  105.41,53.34 90 top
R30  101.6,53.34 90 top
R31  97.79,53.34 90 top
R32  93.98,53.34 90 top
R33  151.13,53.34 90 top
R34  147.32,53.34 90 top
R35  143.51,53.34 90 top
R36  139.7,53.34 90 top
R37  135.89,53.34 90 top
R38  132.08,53.34 90 top
R39  128.27,53.34 90 top
R40  124.46,53.34 90 top
R111  90.17,11.43 90 top
R112  76.2,11.43 0 top
R113  87.63,15.24 180 top
R211  109.22,11.43 90 top
R212  95.25,11.43 0 top
R213  106.68,15.24 180 top
R311  128.27,22.86 270 top
R312  124.46,11.43 180 top
R313  113.03,15.24 0 top
R411  146.05,22.86 270 top
R412  143.51,11.43 180 top
R413  132.08,15.24 0 top
SJ1  86.36,22.86 0 top
SJ2  105.41,22.86 0 top
SJ3  124.46,22.86 0 top
SJ4  142.24,22.86 0 top
SV1  82.55,7.62 180 top
SV2  100.33,7.62 180 top
SV3  118.11,7.62 180 top
SV4  137.16,7.62 180 top
SV5  59.44,5.59 0 top
SV6  24.13,5.84 0 top
SV7  19.05,72.39 0 top
SV8  41.91,72.39 0 top
SV9  72.39,72.39 0 top
SV10  102.87,72.39 0 top
SV11  133.35,72.39 0 top
U1  16.51,41.91 0 top
U2  45.72,41.91 0 top
U3  76.2,41.91 0 top
U4  106.68,41.91 0 top
U5  137.16,41.91 0 top
U6  110.49,29.21 0 top
U$1  29.21,24.13 0 top

### Tracks (layer width: path | path; a pad name or v marks a point on that pad's centre or on a via)
AGND  (via drill 0.35)  (1 unrouted)
  Top 0.305: SV8.4 SV8.2 SV7.16 SV7.14 SV7.12 SV7.10 SV7.8 SV7.6 SV7.4 SV7.2 3.05,66.55 1.78,66.55 1.27,66.04 1.27,39.37 6.35,34.29 | SV8.6 SV8.8 SV8.10 SV8.12 SV8.14 SV8.16 SV9.2 SV9.4 | SV9.16 SV10.2 SV10.4 | SV10.16 SV11.2 SV11.4 | 6.35,34.29 7.62,35.56 13.97,35.56 | 6.35,34.29 U$1.GND@3 | U2.8 43.02,35.56 | 43.02,35.56 17.78,35.56 | 17.78,35.56 13.97,35.56 | 73.66,35.56 46.99,35.56 | 46.99,35.56 43.02,35.56 | 107.95,35.56 110.49,35.56 | 110.49,35.56 134.62,35.56 | 17.78,35.56 17.78,44.45 18.41,45.09 U1.15 | 46.99,35.56 46.99,44.45 47.62,45.09 U2.15 | 77.47,35.56 77.47,44.45 78.11,45.09 U3.15 | 107.95,35.56 107.95,44.45 108.58,45.09 U4.15 | U5.15 139.06,45.09 138.43,44.45 138.43,36.83 137.16,35.56 134.62,35.56 | C33.- 123.19,14.35 123.19,10.16 126.75,6.6 128.14,6.6 C31.- 130.35,7.79 134.21,11.65 134.21,15.72 C43.- | C13.- 89.28,8 91.44,10.16 91.44,12.7 90.17,13.97 86.36,13.97 85.98,14.35 C11.- 87.41,20.48 90.21,20.48 93.48,23.75 C1.- | C21.- 100.18,15.77 100.18,19.18 101.6,20.6 105.13,20.6 105.86,19.88 | C23.- 105.86,19.88 | 105.86,19.88 107.57,21.59 v115.57,21.59 | v118.11,29.21 U6.11 110.49,29.21 110.49,35.56 | 77.47,35.56 78.74,35.56 79.63,36.45 101.22,36.45 102.23,37.47 U4.8 104.14,37.47 104.14,35.56 107.95,35.56 | U1.8 13.97,37.3 13.97,35.56 | 73.66,35.56 77.47,35.56 | U3.8 73.66,37.3 73.66,35.56 | U5.8 134.62,37.3 134.62,35.56
  Bottom 0.305: C1.- 95.63,23.75 101.6,17.78 104.14,17.78 105.03,18.67 C23.- | v115.57,21.59 115.95,21.59 117.03,20.51 | 117.03,20.51 C33.- 118.11,19.43 | C43.- 137.54,13.97 C41.- | v118.11,29.21 118.11,21.59 117.03,20.51
DGND
  Top 0.305: SV1.3 82.55,5.08 97.79,5.08 | 97.79,6.35 SV2.3 97.79,5.08 | 115.57,5.08 97.79,5.08 | SV3.3 115.57,5.08 | 115.57,5.08 132.08,5.08 SV4.3
N$1  (via drill 0.35)
  Top 0.305: v40.64,38.1 40.01,37.47 U1.9 | U2.10 v50.29,38.73
  Bottom 0.305: v40.64,38.1 41.27,38.73 v50.29,38.73
N$2
  Top 0.305: R8.2 2.79,64.77 3.81,64.77 | U1.6 10.79,40.01 3.81,46.99 3.81,64.77 | 3.81,64.77 SV7.1
N$3
  Top 0.305: SV7.3 12.45,71.12 R7.2 5.08,63.75 5.08,46.99 10.79,41.28 U1.5
N$4
  Top 0.305: SV7.5 15.24,70.1 R6.2 8.89,65.02 7.62,63.75 7.62,45.72 10.79,42.55 U1.4
N$5
  Top 0.305: SV7.7 17.78,68.83 R5.2 8.89,59.94 8.89,45.72 10.79,43.82 U1.3
N$6
  Top 0.305: SV7.9 20.32,67.56 R4.2 19.05,63.75 19.05,52.07 20.32,50.8 20.32,44.45 19.68,43.82 U1.14
N$7
  Top 0.305: SV7.11 22.86,66.29 R3.2 20.32,63.75 20.32,52.07 21.59,50.8 21.59,44.45 19.68,42.55 U1.13
N$8
  Top 0.305: SV7.13 R2.2 22.86,62.48 22.86,44.45 19.68,41.28 U1.12
N$9
  Top 0.305: SV7.15 29.21,69.85 R1.2 24.13,59.94 24.13,44.45 19.68,40.01 U1.11
N$10  (via drill 0.35)
  Top 0.305: 13.34,45.09 U1.2 12.06,45.09 11.43,45.72 11.43,46.99 12.7,48.26 16.51,48.26 v17.53,47.24 | v40.64,46.99 42.55,45.09 U2.2 | v71.12,46.99 71.12,45.72 71.75,45.09 U3.2 | v101.6,46.99 103.5,45.09 U4.2 | v132.08,46.99 133.99,45.09 U5.2
  Bottom 0.305: U$1.PA_3 23.5,45.09 | 23.5,45.09 21.34,47.24 v17.53,47.24 | v132.08,46.99 v101.6,46.99 v71.12,46.99 v40.64,46.99 25.4,46.99 23.5,45.09
N$13
  Top 0.305: SV8.1 R16.2 34.29,63.75 34.29,46.99 41.27,40.01 U2.6
N$14
  Top 0.305: SV8.3 35.56,66.04 36.58,65.02 R15.2 36.83,64.77 35.56,63.5 35.56,46.99 41.27,41.28 U2.5
N$15
  Top 0.305: SV8.5 38.1,67.56 R14.2 40.64,64.77 38.1,62.23 38.1,45.72 41.27,42.55 U2.4
N$16
  Top 0.305: SV8.7 40.64,68.83 R13.2 39.37,59.94 39.37,45.72 41.27,43.82 U2.3
N$18
  Top 0.305: SV9.1 R24.2 64.77,63.75 64.77,46.99 71.75,40.01 U3.6
N$19
  Top 0.305: SV9.3 66.04,66.29 R23.2 67.31,64.77 66.04,63.5 66.04,46.99 71.75,41.28 U3.5
N$20
  Top 0.305: SV9.5 68.58,67.56 R22.2 68.58,62.48 68.58,45.72 71.75,42.55 U3.4
N$21
  Top 0.305: SV9.7 71.12,68.83 R21.2 69.85,59.94 69.85,45.72 71.75,43.82 U3.3
N$22
  Top 0.305: SV9.9 78.74,66.04 R20.2 78.74,60.96 83.82,55.88 83.82,46.99 80.64,43.82 U3.14
N$23
  Top 0.305: SV9.11 82.3,65.02 R19.2 82.55,60.96 85.09,58.42 85.09,46.99 80.64,42.55 U3.13
N$24
  Top 0.305: SV9.13 84.84,65.02 R18.2 86.36,57.15 87.63,55.88 87.63,48.26 80.64,41.28 U3.12
N$25
  Top 0.305: SV8.9 43.18,70.1 R12.2 53.34,59.94 53.34,46.99 50.16,43.82 U2.14
N$26
  Top 0.305: SV10.1 R32.2 95.25,63.75 95.25,46.99 102.23,40.01 U4.6
N$27
  Top 0.305: SV10.3 96.52,66.29 R31.2 97.79,64.77 96.52,63.5 96.52,46.99 102.23,41.28 U4.5
N$28
  Top 0.305: SV10.5 99.06,67.56 R30.2 99.06,62.48 99.06,45.72 102.23,42.55 U4.4
N$29
  Top 0.305: SV10.7 101.6,68.83 R29.2 100.33,59.94 100.33,45.72 102.23,43.82 U4.3
N$30
  Top 0.305: SV10.9 104.14,70.1 R28.2 109.22,60.96 114.3,55.88 114.3,46.99 111.12,43.82 U4.14
N$31
  Top 0.305: SV10.11 106.68,70.61 112.27,65.02 R27.2 113.03,60.96 115.57,58.42 115.57,46.99 111.12,42.55 U4.13
N$32
  Top 0.305: SV10.13 115.32,65.02 R26.2 116.84,57.15 118.11,55.88 118.11,48.26 111.12,41.28 U4.12
N$33
  Top 0.305: SV11.15 143.76,71.12 149.86,65.02 R33.2 151.13,57.15 149.86,55.88 149.86,48.26 141.6,40.01 U5.11
N$34
  Top 0.305: SV10.15 114.55,71.12 R25.2 120.65,57.15 119.38,55.88 119.38,48.26 111.12,40.01 U4.11
N$35
  Top 0.305: SV11.13 139.95,71.12 146.05,65.02 R34.2 147.32,57.15 148.59,55.88 148.59,48.26 141.6,41.28 U5.12
N$36
  Top 0.305: SV8.11 45.97,71.12 R11.2 54.61,62.48 54.61,46.99 50.16,42.55 U2.13
N$37
  Top 0.305: SV11.11 143.26,65.02 R35.2 143.51,60.96 146.05,58.42 146.05,46.99 141.6,42.55 U5.13
N$38
  Top 0.305: SV11.9 134.62,69.85 139.45,65.02 R36.2 139.7,60.96 144.78,55.88 144.78,46.99 141.6,43.82 U5.14
N$39
  Top 0.305: SV11.7 132.08,68.83 R37.2 130.81,59.94 130.81,45.72 132.72,43.82 U5.3
N$40
  Top 0.305: SV11.5 129.54,67.56 R38.2 129.54,62.48 129.54,45.72 132.72,42.55 U5.4
N$41
  Top 0.305: SV11.3 127,66.29 R39.2 128.27,64.77 127,63.5 127,46.99 132.72,41.28 U5.5
N$42  (via drill 0.35)
  Top 0.305: U2.9 70.48,37.47 v71.12,38.1 | U3.10 81.92,38.73 v82.55,39.37
  Bottom 0.305: v71.12,38.1 81.28,38.1 v82.55,39.37
N$44
  Top 0.305: R111.1 R112.2 84.2,15.11 C11.+
N$45  (via drill 0.35)
  Top 0.305: U3.9 100.97,37.47 v101.6,38.1 | U4.10 v113.92,38.73
  Bottom 0.305: v101.6,38.1 113.28,38.1 v113.92,38.73
N$46  (via drill 0.35)
  Top 0.305: U4.9 131.44,37.47 v132.08,38.1 | v142.24,38.73 U5.10
  Bottom 0.305: v132.08,38.1 132.72,38.73 v142.24,38.73
N$47  (via drill 0.35)
  Top 0.305: U5.9 139.87,35.73 135.89,31.75 135.89,24.72 134.62,23.45 132.14,23.45 128.23,27.35 104.52,27.35 100.03,22.86 97.79,22.86 95.25,25.4 93.98,25.4 92.71,24.13 91.44,24.13 90.76,24.81 90.76,26.63 95.3,31.18 108.66,31.18 109.22,31.74 109.22,33.4 108.39,34.23 94.54,34.23 85.71,25.4 v43.18,25.4
  Bottom 0.305: U$1.PA_4 40.64,25.4 v43.18,25.4
N$48  (via drill 0.35)  (3 unrouted)
  Top 0.305: v16.51,45.72 15.88,46.36 U1.1 | U2.1 42.55,46.36 v40.64,48.26 | v71.12,48.26 71.59,48.26 U3.1 | v101.6,48.26 102.07,48.26 U4.1 | v132.08,48.26 132.55,48.26 U5.1
  Bottom 0.305: U$1.PA_5 31.75,35.05 21.08,45.72 v16.51,45.72 16.51,46.02 15.83,46.71 15.83,47.27 16.81,48.26 v40.64,48.26 v71.12,48.26 v101.6,48.26 v132.08,48.26
N$49
  Top 0.305: SV11.1 R40.2 125.73,63.75 125.73,46.99 132.72,40.01 U5.6
N$50
  Top 0.305: R212.1 95,11.68 R213.2 95,18.41 C22.-
N$51
  Top 0.305: R212.2 R211.1 110.11,10.54 C21.+
N$52  (via drill 0.35)
  Top 0.305: R113.1 90.17,15.24 92.71,12.7 92.71,9.27 C13.+ | U6.3 97.28,30.48 v92.46,25.65
  Bottom 0.305: v92.46,25.65 90.42,25.65 87.63,22.86 R113.1
N$53
  Top 0.305: C12.+ 83.44,22.86 SJ1.1 85.6,23.37 94.23,32 107.43,32 U6.2 U6.1
  Bottom 0.305: U$1.PA_7 27.08,31.75 28.79,33.46 29.63,33.46 30.22,32.87 30.22,30.74 36.37,24.59 57.34,24.59 60.34,21.59 77.47,21.59 79.63,19.43 C12.+
N$54
  Top 0.305: R112.1 75.95,11.68 R113.2 75.95,17.14 C12.-
N$55
  Top 0.305: SV8.13 54.36,65.02 R10.2 57.15,63.75 57.15,48.26 50.16,41.28 U2.12
N$56
  Top 0.305: SV8.15 51.05,71.37 53.59,71.37 59.69,65.28 R9.2 58.42,63.75 58.42,48.26 50.16,40.01 U2.11
N$57
  Top 0.305: R412.2 132.08,11.68 R413.1 132.08,18.67 C42.-
N$58  (via drill 0.35)
  Top 0.305: C23.+ 103.25,17.91 105.92,15.24 R213.1 | U6.5 101.6,27.94 99.06,25.4 v99.06,24.13
  Bottom 0.305: C23.+ 99.06,23.24 v99.06,24.13
N$60
  Top 0.305: SV9.15 84.07,71.12 R17.2 90.17,57.15 88.9,55.88 88.9,48.26 80.64,40.01 U3.11
N$62  (via drill 0.35)
  Top 0.305: R313.2 124.08,15.24 C33.+ | U6.12 v119.38,30.48
  Bottom 0.305: C33.+ 120.27,29.59 v119.38,30.48
N$64
  Top 0.305: R311.2 128.02,11.43 127,11.43 | 127,11.43 R312.1 | C31.+ 128.14,9.02 127,10.16 127,11.43
N$65  (via drill 0.35)
  Top 0.305: R413.2 139.95,19.05 C43.+ | U6.10 130.81,27.94 v133.35,25.4
  Bottom 0.305: v133.35,25.4 139.32,19.43 C43.+
N$68
  Top 0.305: R412.1 143.64,11.3 145.92,11.3 R411.2 146.05,8 C41.+
N$72
  Top 0.305: R312.2 113.03,11.68 R313.1 113.03,18.67 C32.-
N$95
  Top 0.305: U$1.PA_2 39.37,29.59 32.64,22.86 27.94,22.86 25.4,20.32 25.4,10.16 24.13,8.89 SV6.7
N$99
  Bottom 0.305: U$1.5V 49.53,15.11 40.69,6.27 40.69,3.88 39.61,2.79 31.64,2.79 30.56,3.88 30.56,7.4 30.03,7.93 22.93,7.93 21.59,6.59 SV6.6
N$A8
  Bottom 0.305: U$1.PA_8 16.51,16.74 18.5,18.73 27.09,18.73 27.95,17.87 27.95,14.75 29.36,13.34 33.27,13.34 39.37,7.24 SV6.13
N$A9
  Bottom 0.305: U$1.PA_9 19.05,13.34 22.23,10.16 33.4,10.16 36.83,6.73 SV6.12
N$A10
  Bottom 0.305: U$1.PA_10 21.59,12.7 23.04,11.25 33.94,11.25 38.15,7.05 38.15,4.51 37.4,3.76 34.85,3.76 34.29,4.32 SV6.11
N$A11  (via drill 0.35)
  Top 0.305: v24.13,12.7 24.13,10.16 v22.86,8.89
  Bottom 0.305: U$1.PA_11 v24.13,12.7 | SV6.10 31.75,7.62 30.48,8.89 v22.86,8.89
N$A12
  Top 0.305: U$1.PA_12 26.67,10.79 29.21,8.26 SV6.9
N$A15
  Top 0.305: U$1.PA_15 29.21,10.17 30.53,8.85 30.53,4.38 30.03,3.89 27.75,3.89 26.67,4.97 SV6.8
N$B0  (via drill 0.35)
  Top 0.305: v58.04,11.43 54.93,14.54 51.52,14.54 50.81,15.26 50.81,18.38 48.49,20.7 v35.69,20.7
  Bottom 0.305: SV5.1 44.2,7.37 48.26,11.43 v58.04,11.43 | v35.69,20.7 24.64,31.75 U$1.PB_0
N$B1  (via drill 0.35)
  Top 0.305: v60.96,10.16 55.62,15.5 55.62,17.63 51.66,21.59 v39.37,21.59
  Bottom 0.305: SV5.2 46.74,7.37 49.53,10.16 v60.96,10.16 | v39.37,21.59 39.07,21.59 37.24,19.76 33.58,19.76 U$1.PB_1
N$B3
  Top 0.305: SV5.3 49.28,6.86 48.51,7.62 41.9,7.62 37.33,12.19 36.07,12.19 U$1.PB_3
N$B4
  Top 0.305: SV5.4 51.82,6.86 49.78,8.89 42.42,8.89 37.47,13.84 35.69,13.84 34.29,15.24 U$1.PB_4
N$B5
  Top 0.305: U$1.PB_5 36.83,16.13 42.8,10.16 51.05,10.16 54.36,6.86 SV5.5
N$B6
  Top 0.305: U$1.PB_6 39.37,15.88 43.81,11.43 52.32,11.43 56.9,6.86 SV5.6
N$B7
  Top 0.305: U$1.PB_7 41.91,16 45.21,12.7 52.58,12.7 57.4,7.87 58.8,7.87 59.44,7.24 SV5.7
N$B8
  Top 0.305: U$1.PB_8 44.45,15.75 46.48,13.72 53.59,13.72 58.42,8.89 60.96,8.89 61.98,7.87 SV5.8
N$B9
  Bottom 0.305: U$1.PB_9 46.99,17.14 48.7,18.86 56.83,18.86 64.52,11.18 SV5.9
N$B10
  Bottom 0.305: U$1.PB_10 31.75,19.05 | 31.75,19.05 31.88,18.92 | SV5.10 67.06,10.79 57.53,20.32 43.18,20.32 41.91,19.05 31.75,19.05
N$B11  (via drill 0.35)
  Top 0.305: SV5.11 69.6,3.95 68.69,3.05 42.93,3.05 41.91,4.06 41.91,6.22 v37.08,11.05
  Bottom 0.305: U$1.PB_11 30.49,17.77 30.49,15.26 31.33,14.42 33.72,14.42 v37.08,11.05
N$B12
  Top 0.305: U$1.PB_12 7.19,15.67 7.19,3.24 9.19,1.25 74.51,1.25 76.38,3.11 76.38,6.92 75.5,7.8 73.58,7.8 72.14,6.35 SV5.12
N$B13
  Top 0.305: U$1.PB_13 8.89,16.61 11.01,18.73 12.1,18.73 12.69,18.14 12.69,12.07 10.11,9.49 10.11,3.88 11.9,2.08 72.93,2.08 74.68,3.83 SV5.13
N$B14
  Top 0.305: 8.89,7.11 SV6.1 8.89,10.16 11.43,12.7 U$1.PB_14
N$B15
  Top 0.305: 11.43,7.11 SV6.2 11.43,8.89 13.97,11.43 U$1.PB_15
N$C13
  Top 0.305: SV6.3 13.97,5.97 23.12,15.12 23.12,19.58 27.37,23.82 31.04,23.82 38.11,30.9 38.11,33.13 38.83,33.84 50.08,33.84 52.07,31.85 U$1.PC_13
N$C14  (via drill 0.35)
  Top 0.305: SV6.4 16.51,6.98 17.58,8.05 21.78,8.05 22.94,6.89 22.94,3.62 23.51,3.05 32.44,3.05 32.94,3.56 32.94,8.23 30.74,10.43 30.74,17.63 35.51,22.4 38.5,22.4 45.46,29.36 46.84,29.36 v46.99,29.21
  Bottom 0.305: U$1.PC_14 49.53,30.48 48.26,29.21 v46.99,29.21
N$C15
  Top 0.305: SV6.5 19.05,5.1 17.84,3.89 13.27,3.89 12.78,4.38 12.78,7.81 20.12,15.16 20.12,18.37 26.42,24.66 29.33,24.66 35.57,30.9 35.57,33.38 36.87,34.68 52.28,34.68 53.33,33.63 53.33,30.25 52.62,29.53 48.45,29.53 46.99,30.99 U$1.PC_15
N$FILTER2OUT
  Top 0.305: C22.+ 101.22,22.86 SJ2.1 104.65,24.64 105.41,25.4 U6.7 U6.6
  Bottom 0.305: C22.+ 94.59,16.23 92.33,13.97 66.04,13.97 57.15,22.86 35.94,22.86 29.21,29.59 U$1.PA_6
N$FILTER3OUT  (via drill 0.35)
  Top 0.305: v114.3,22.86 SJ3.1 | v115.57,31.75 U6.13 U6.14 v115.57,33.02
  Bottom 0.305: C32.+ 115.19,20.19 114.3,21.08 v114.3,22.86 115.57,24.13 v115.57,31.75 | v115.57,33.02 114.3,34.29 46.99,34.29 U$1.PA_0
N$FILTER4OUT  (via drill 0.35)
  Top 0.305: C42.+ 134.43,19.24 | 134.43,19.24 138.05,22.86 SJ4.1 | 134.43,19.24 128.27,25.4 U6.8 U6.9 v110.49,26.67
  Bottom 0.305: v110.49,26.67 46.99,26.67 U$1.PA_1
N$POT1IN
  Top 0.305: R111.2 89.92,22.86 SJ1.2 87.12,22.35 86.36,21.59 83.32,21.59 81.28,19.55 81.28,12.7 82.55,11.43 SV1.2
N$POT2IN
  Top 0.305: SJ2.2 106.43,23.11 | 106.43,23.11 R211.2 | SV2.2 100.33,12.7 99.06,13.97 99.06,19.55 101.1,21.59 105.41,21.59 106.43,22.61 106.43,23.11
N$POT3IN
  Top 0.305: R311.1 SJ3.2 125.22,21.08 124.46,20.32 121.92,20.32 120.65,21.59 118.11,21.59 116.84,20.32 116.84,12.7 118.11,11.43 SV3.2
N$POT4IN
  Top 0.305: R411.1 SJ4.2 143,19.56 145.03,17.53 145.03,14.22 144.02,13.21 141.48,13.21 137.16,8.89 SV4.2
VCC  (via drill 0.35)
  Top 0.305: U1.16 19.21,50.16 17.78,51.6 R4.1 | U2.16 48.26,46.52 R12.1 | R20.1 78.74,46.52 U3.16 80.39,46.36 v80.9,45.85 | U4.16 109.22,46.52 R28.1 | U5.16 139.7,46.52 R36.1 | C1.+ 93.98,10.16 | 93.98,10.16 93.98,7.98 92.71,6.71 87.63,6.71 86.72,7.62 SV1.1 | SV4.1 139.7,6.35 138.94,5.59 136.65,5.59 135.89,6.35 135.89,8.89 134.62,10.16 134.11,10.16 129.84,5.89 125.54,5.89 123.81,7.62 SV3.1 120.65,6.81 119.51,5.66 117.41,5.66 116.84,6.24 116.84,9.02 116.2,9.65 114.17,9.65 110.85,6.33 107.7,6.33 106.4,7.62 SV2.1 100.79,5.54 99.76,5.54 99.06,6.24 99.06,8.89 97.79,10.16 93.98,10.16 | v97.79,25.4 v97.79,27.94 99.06,29.21 U6.4 | v91.44,33.02 89.15,35.31 v86.36,35.31
  Bottom 0.305: R8.1 R7.1 R6.1 11.43,53.34 | 11.43,53.34 R5.1 R4.1 R3.1 R2.1 R1.1 R16.1 R15.1 R14.1 R13.1 R12.1 R11.1 R10.1 R9.1 R24.1 R23.1 R22.1 R21.1 R20.1 R19.1 R18.1 R17.1 R32.1 R31.1 R30.1 R29.1 R28.1 R27.1 R26.1 R25.1 R40.1 R39.1 R38.1 R37.1 R36.1 R35.1 R34.1 R33.1 | U$1.3.3V@2 11.43,53.34 | v97.79,25.4 94.34,25.4 93.07,24.13 93.07,23.37 93.98,22.46 C1.+ | v97.79,27.94 96.52,27.94 v91.44,33.02 | v86.36,35.31 86.36,41.91 82.42,45.85 v80.9,45.85

### Text on the board
tNames: GND | IN | VCC | GND | IN | VCC | GND | IN | VCC | GND | IN | VCC | B15 | C13 | C14 | C15 | 5V | A2 | A13 | A12 | A11 | A10 | A9 | A8 | B1 | B3 | B4 | B5 | B6 | B7 | B8 | B9 | B10 | B11 | B12 | B13 | B14 | B0